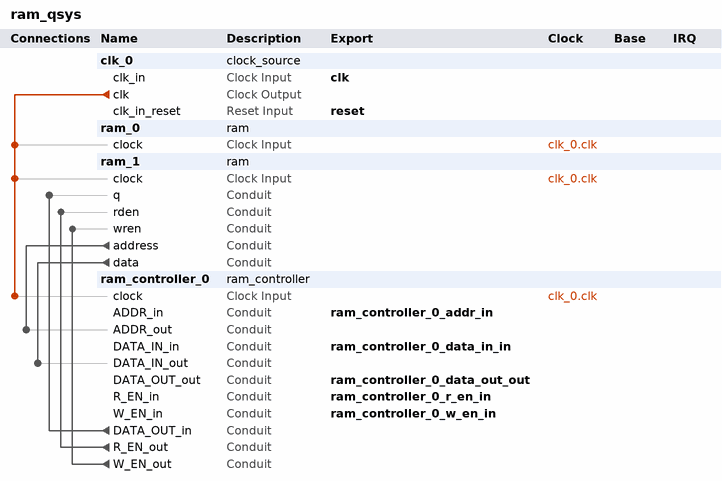
[diagram p0: system contents]
# Platform Designer (Qsys) system ram_qsys, Cyclone V 5CGTFD9E5F35C7
# Parameters at their usual value, and those the tool derives, are not listed.
package require -exact qsys 21.1
create_system ram_qsys
set_project_property DEVICE_FAMILY {Cyclone V}
set_project_property DEVICE 5CGTFD9E5F35C7

add_instance clk_0 clock_source 21.1
set_instance_parameter_value clk_0 clockFrequency 50000000

add_instance ram_0 ram 1.0

add_instance ram_1 ram 1.0

add_instance ram_controller_0 ram_controller 1.0

# connections
add_connection clk_0.clk ram_0.clock clock
add_connection clk_0.clk ram_1.clock clock
add_connection clk_0.clk ram_controller_0.clock clock
add_connection ram_1.address ram_controller_0.ADDR_out conduit
add_connection ram_1.data ram_controller_0.DATA_IN_out conduit
add_connection ram_controller_0.DATA_OUT_in ram_1.q conduit
add_connection ram_controller_0.R_EN_out ram_1.rden conduit
add_connection ram_controller_0.W_EN_out ram_1.wren conduit

# exported interfaces
add_interface clk clock sink
set_interface_property clk EXPORT_OF clk_0.clk_in
add_interface ram_controller_0_addr_in conduit end
set_interface_property ram_controller_0_addr_in EXPORT_OF ram_controller_0.ADDR_in
add_interface ram_controller_0_data_in_in conduit end
set_interface_property ram_controller_0_data_in_in EXPORT_OF ram_controller_0.DATA_IN_in
add_interface ram_controller_0_data_out_out conduit end
set_interface_property ram_controller_0_data_out_out EXPORT_OF ram_controller_0.DATA_OUT_out
add_interface ram_controller_0_r_en_in conduit end
set_interface_property ram_controller_0_r_en_in EXPORT_OF ram_controller_0.R_EN_in
add_interface ram_controller_0_w_en_in conduit end
set_interface_property ram_controller_0_w_en_in EXPORT_OF ram_controller_0.W_EN_in
add_interface reset reset sink
set_interface_property reset EXPORT_OF clk_0.clk_in_reset

set_interconnect_requirement {$system} qsys_mm.clockCrossingAdapter HANDSHAKE
set_interconnect_requirement {$system} qsys_mm.enableEccProtection FALSE
set_interconnect_requirement {$system} qsys_mm.insertDefaultSlave FALSE
set_interconnect_requirement {$system} qsys_mm.maxAdditionalLatency 1

save_system ram_qsys.qsys
